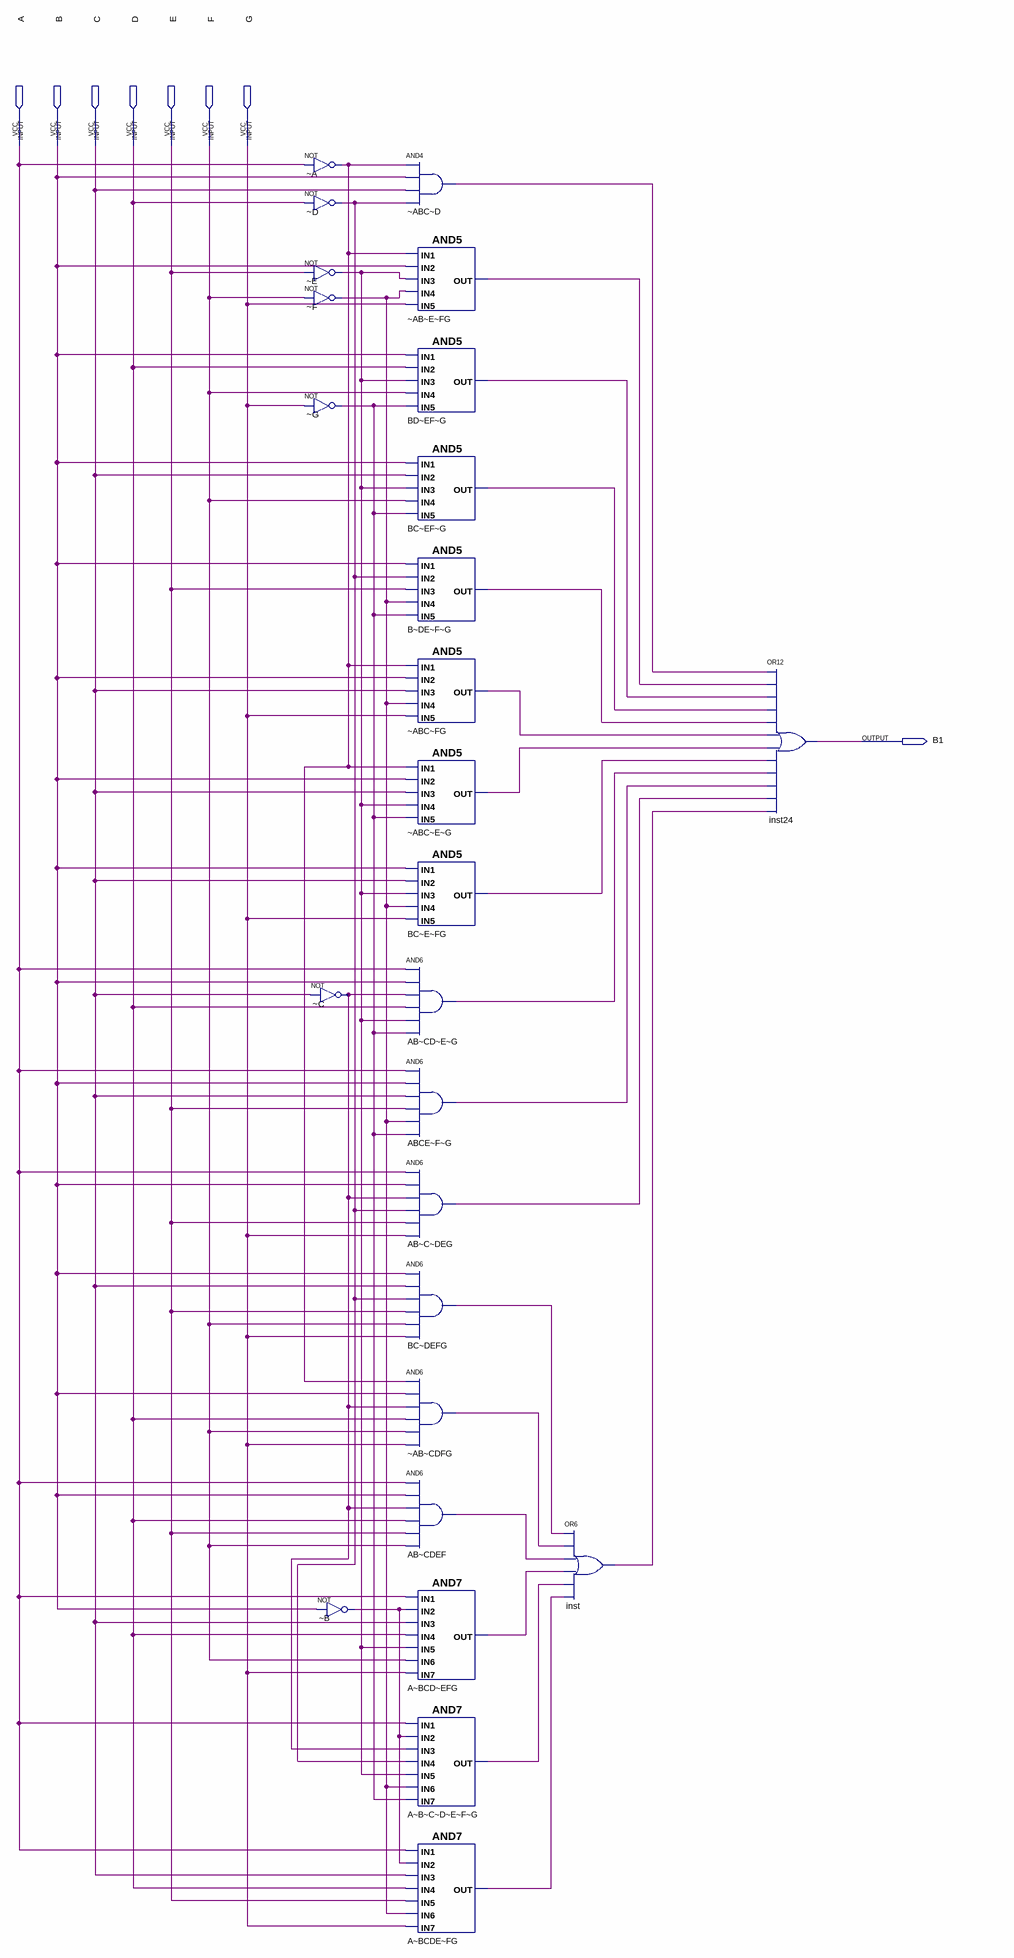
[diagram p0: schematic sheet]
// Quartus schematic posicao5.bdf as structural Verilog: 26 symbols, 8 pins
module posicao5 (
  input  A,
  input  B,
  input  C,
  input  D,
  input  E,
  input  F,
  input  G,
  output B1
);

  wire _A_out, _AB_CDFG_out, _AB_E_FG_out, _ABC_D_out, _ABC_E_G_out, _ABC_FG_out, _B_out, _C_out, _D_out,
       _E_out, _F_out, _G_out, A_B_C_D_E_F_G_out, A_BCD_EFG_out, A_BCDE_FG_out, AB_C_DEG_out, AB_CD_E_G_out,
       AB_CDEF_out, ABCE_F_G_out, B_DE_F_G_out, BC_DEFG_out, BC_E_FG_out, BC_EF_G_out, BD_EF_G_out, inst_out;

  not \u_~A  (_A_out, A);
  not \u_~D  (_D_out, D);
  not \u_~E  (_E_out, E);
  not \u_~F  (_F_out, F);
  not \u_~G  (_G_out, G);
  not \u_~C  (_C_out, C);
  not \u_~B  (_B_out, B);
  and \u_~ABC~D  (_ABC_D_out, _A_out, B, C, _D_out);
  and \u_~AB~E~FG  (_AB_E_FG_out, _A_out, B, _E_out, _F_out, G);
  and \BD~EF~G  (BD_EF_G_out, B, D, _E_out, F, _G_out);
  and \BC~EF~G  (BC_EF_G_out, B, C, _E_out, F, _G_out);
  and \B~DE~F~G  (B_DE_F_G_out, B, _D_out, E, _F_out, _G_out);
  and \u_~ABC~FG  (_ABC_FG_out, _A_out, B, C, _F_out, G);
  and \u_~ABC~E~G  (_ABC_E_G_out, _A_out, B, C, _E_out, _G_out);
  and \BC~E~FG  (BC_E_FG_out, B, C, _E_out, _F_out, G);
  and \AB~CD~E~G  (AB_CD_E_G_out, A, B, _C_out, D, _E_out, _G_out);
  and \ABCE~F~G  (ABCE_F_G_out, A, B, C, E, _F_out, _G_out);
  and \AB~C~DEG  (AB_C_DEG_out, A, B, _C_out, _D_out, E, G);
  and \BC~DEFG  (BC_DEFG_out, B, C, _D_out, E, F, G);
  and \u_~AB~CDFG  (_AB_CDFG_out, _A_out, B, _C_out, D, F, G);
  and \AB~CDEF  (AB_CDEF_out, A, B, _C_out, D, E, F);
  and \A~BCD~EFG  (A_BCD_EFG_out, A, _B_out, C, D, _E_out, F, G);
  and \A~B~C~D~E~F~G  (A_B_C_D_E_F_G_out, A, _B_out, _C_out, _D_out, _E_out, _F_out, _G_out);
  and \A~BCDE~FG  (A_BCDE_FG_out, A, _B_out, C, D, E, _F_out, G);
  or inst (inst_out, BC_DEFG_out, _AB_CDFG_out, AB_CDEF_out, A_BCD_EFG_out, A_B_C_D_E_F_G_out, A_BCDE_FG_out);
  or inst24 (B1, _ABC_D_out, _AB_E_FG_out, BD_EF_G_out, BC_EF_G_out, B_DE_F_G_out, _ABC_FG_out, _ABC_E_G_out, BC_E_FG_out, AB_CD_E_G_out, ABCE_F_G_out, AB_C_DEG_out, inst_out);
endmodule
